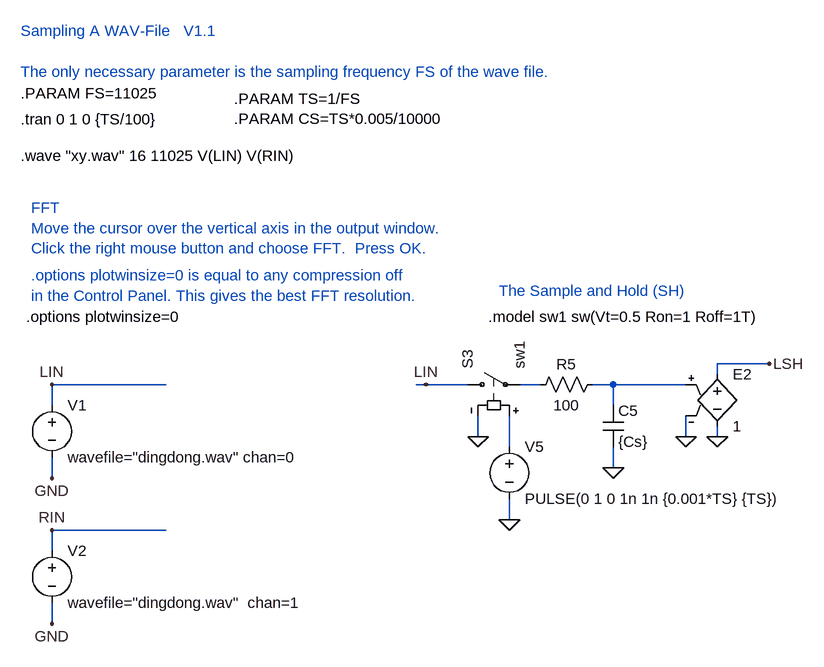
[diagram p0: schematic Wav_SH1.asc]
Wav_SH1.asc, the LTspice schematic file:
Version 4
SHEET 1 1932 1728
WIRE 672 848 672 816
WIRE 672 816 848 816
WIRE 672 624 672 592
WIRE 672 592 848 592
WIRE 672 928 672 960
WIRE 672 704 672 736
WIRE 1536 624 1536 592
WIRE 1536 592 1504 592
WIRE 1424 592 1392 592
WIRE 1536 720 1536 688
WIRE 1536 592 1648 592
WIRE 1648 640 1648 672
WIRE 1696 656 1696 672
WIRE 1696 576 1696 560
WIRE 1312 592 1248 592
WIRE 1328 640 1328 672
WIRE 1376 688 1376 640
WIRE 1376 768 1376 800
WIRE 1248 592 1232 592
WIRE 1696 560 1776 560
FLAG 672 736 GND
FLAG 672 960 GND
FLAG 672 592 LIN
FLAG 1536 720 0
FLAG 1648 672 0
FLAG 1696 672 0
FLAG 1248 592 LIN
FLAG 1328 672 0
FLAG 1376 800 0
FLAG 1776 560 LSH
FLAG 672 816 RIN
SYMBOL VOLTAGE 672 608 R0
SYMATTR InstName V1
SYMATTR Value wavefile="dingdong.wav" chan=0
SYMBOL voltage 672 832 R0
WINDOW 39 0 0 Left 0
WINDOW 123 0 0 Left 0
SYMATTR InstName V2
SYMATTR Value wavefile="dingdong.wav"  chan=1
SYMBOL sw 1296 592 R270
SYMATTR InstName S3
SYMATTR Value sw1
SYMBOL cap 1520 624 R0
SYMATTR InstName C5
SYMATTR Value {Cs}
SYMBOL res 1408 608 R270
WINDOW 0 32 56 VTop 0
WINDOW 3 0 56 VBottom 0
SYMATTR InstName R5
SYMATTR Value 100
SYMBOL e 1696 560 R0
SYMATTR InstName E2
SYMATTR Value 1
SYMBOL voltage 1376 672 R0
WINDOW 123 0 0 Left 0
WINDOW 39 0 0 Left 0
SYMATTR InstName V5
SYMATTR Value PULSE(0 1 0 1n 1n {0.001*TS} {TS})
TEXT 624 184 Left 0 !.tran 0 1 0 {TS/100}
TEXT 624 240 Left 0 !.wave "xy.wav" 16 11025 V(LIN) V(RIN)
TEXT 1344 488 Left 0 !.model sw1 sw(Vt=0.5 Ron=1 Roff=1T)
TEXT 624 144 Left 0 !.PARAM FS=11025
TEXT 1360 448 Left 0 ;The Sample and Hold (SH)
TEXT 624 48 Left 0 ;Sampling A WAV-File   V1.1\n \nThe only necessary parameter is the sampling frequency FS of the wave file.
TEXT 952 152 Left 0 !.PARAM TS=1/FS\n.PARAM CS=TS*0.005/10000
TEXT 632 488 Left 0 !.options plotwinsize=0
TEXT 640 424 Left 0 ;.options plotwinsize=0 is equal to any compression off\nin the Control Panel. This gives the best FFT resolution.
TEXT 640 320 Left 0 ;FFT\nMove the cursor over the vertical axis in the output window.\nClick the right mouse button and choose FFT.  Press OK.

The netlist it stands for:
* Wav_SH1.asc
V1 LIN GND wavefile="dingdong.wav" chan=0
V2 RIN GND wavefile="dingdong.wav"  chan=1
S3 LIN N002 N003 0 sw1
C5 N001 0 {Cs}
R5 N002 N001 100
E2 LSH 0 N001 0 1
V5 N003 0 PULSE(0 1 0 1n 1n {0.001*TS} {TS})
.tran 0 1 0 {TS/100}
.wave "xy.wav" 16 11025 V(LIN) V(RIN)
.model sw1 sw(Vt=0.5 Ron=1 Roff=1T)
.PARAM FS=11025
* The Sample and Hold (SH)
* Sampling A WAV-File   V1.1
* The only necessary parameter is the sampling frequency FS of the wave file.
.PARAM TS=1/FS
.PARAM CS=TS*0.005/10000
.options plotwinsize=0
* .options plotwinsize=0 is equal to any compression off
* in the Control Panel. This gives the best FFT resolution.
* FFT
* Move the cursor over the vertical axis in the output window.
* Click the right mouse button and choose FFT.  Press OK.
.backanno
.end